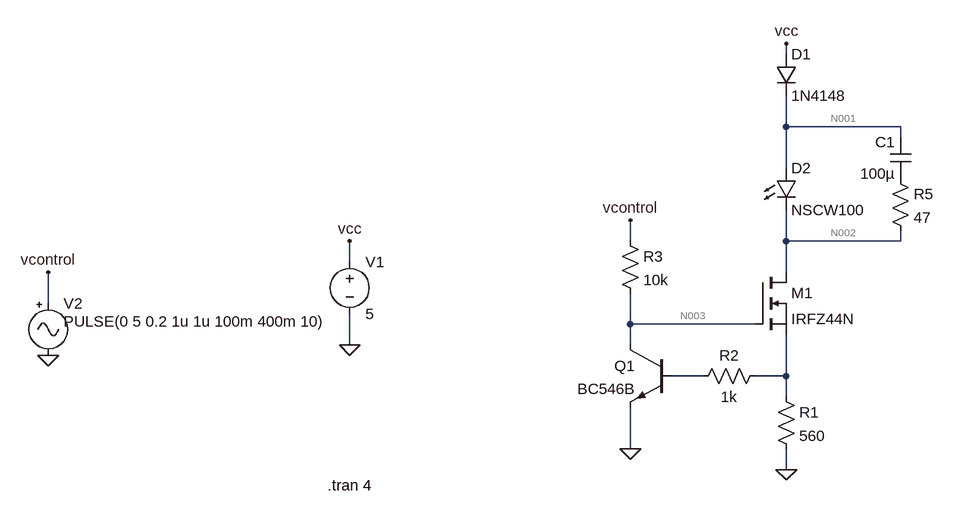
[diagram p0: schematic SVETLA.asc]
SVETLA.asc, the LTspice schematic file:
Version 4
SHEET 1 880 680
WIRE 128 -208 128 -224
WIRE 128 -96 128 -144
WIRE 304 -96 128 -96
WIRE 304 -80 304 -96
WIRE 128 -32 128 -96
WIRE -112 80 -112 48
WIRE 128 80 128 32
WIRE 304 80 304 64
WIRE 304 80 128 80
WIRE -544 112 -544 80
WIRE 128 128 128 80
WIRE -1008 176 -1008 128
WIRE -112 208 -112 160
WIRE 80 208 -112 208
WIRE -544 240 -544 192
WIRE -112 240 -112 208
WIRE 0 288 -48 288
WIRE 128 288 128 224
WIRE 128 288 80 288
WIRE 128 320 128 288
WIRE -112 400 -112 336
WIRE 128 432 128 400
FLAG 128 432 0
FLAG -112 400 0
FLAG -544 240 0
FLAG -544 80 vcc
FLAG -1008 256 0
FLAG -1008 128 vcontrol
FLAG -112 48 vcontrol
FLAG 128 -224 vcc
SYMBOL nmos 80 128 R0
SYMATTR InstName M1
SYMATTR Value IRFZ44N
SYMBOL res 112 304 R0
SYMATTR InstName R1
SYMATTR Value 560
SYMBOL res 96 272 R90
WINDOW 0 0 56 VBottom 2
WINDOW 3 32 56 VTop 2
SYMATTR InstName R2
SYMATTR Value 1k
SYMBOL npn -48 240 M0
SYMATTR InstName Q1
SYMATTR Value BC546B
SYMBOL res -128 64 R0
SYMATTR InstName R3
SYMATTR Value 10k
SYMBOL voltage -544 96 R0
WINDOW 123 0 0 Left 0
WINDOW 39 0 0 Left 0
SYMATTR InstName V1
SYMATTR Value 5
SYMBOL Misc\\signal -1008 160 R0
WINDOW 3 24 44 Left 2
WINDOW 123 0 0 Left 0
WINDOW 39 0 0 Left 0
SYMATTR InstName V2
SYMATTR Value PULSE(0 5 0.2 1u 1u 100m 400m 10)
SYMBOL diode 112 -208 R0
SYMATTR InstName D1
SYMATTR Value 1N4148
SYMBOL cap 320 -16 R180
WINDOW 0 24 56 Left 2
WINDOW 3 24 8 Left 2
SYMATTR InstName C1
SYMATTR Value 100µ
SYMBOL res 288 -32 R0
SYMATTR InstName R5
SYMATTR Value 47
SYMBOL LED 112 -32 R0
SYMATTR InstName D2
SYMATTR Value NSCW100
SYMATTR Description Diode
SYMATTR Type diode
TEXT -578 456 Left 2 !.tran 4

The netlist it stands for:
* SVETLA.asc
M1 N002 N003 N005 N005 IRFZ44N
R1 N005 0 560
R2 N005 N004 1k
Q1 N003 N004 0 0 BC546B
R3 vcontrol N003 10k
V1 vcc 0 5
V2 vcontrol 0 PULSE(0 5 0.2 1u 1u 100m 400m 10)
D1 vcc N001 1N4148
C1 P001 N001 100µ
R5 P001 N002 47
D2 N001 N002 NSCW100
.model D D
.lib standard.dio
.model NPN NPN
.model PNP PNP
.lib standard.bjt
.model NMOS NMOS
.model PMOS PMOS
.lib standard.mos
.tran 4
.backanno
.end

* Results of the author's LTspice run, read from the files saved beside the schematic
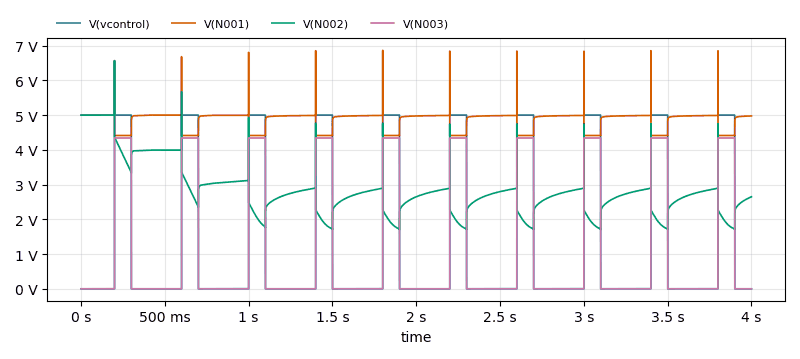
[diagram p1: Transient Analysis of SVETLA.asc, plotted from the saved traces]
* Transient Analysis, 1 run:
*   V(vcontrol): min 0 V, max 5 V, average 1.25 V, rms 2.5 V, last 0 V
*   V(N001): min 4.405 V, max 6.865 V, average 4.84 V, rms 4.846 V, last 4.977 V
*   V(N002): min 1.704 V, max 6.57 V, average 2.814 V, rms 2.912 V, last 2.649 V
*   V(N003): min -34.87 µV, max 4.344 V, average 1.086 V, rms 2.172 V, last 7.002 µV